# Altium schematic sheet Rotary-Encoder.SchDoc
size B; SheetNumber: 15; SheetTotal: 17
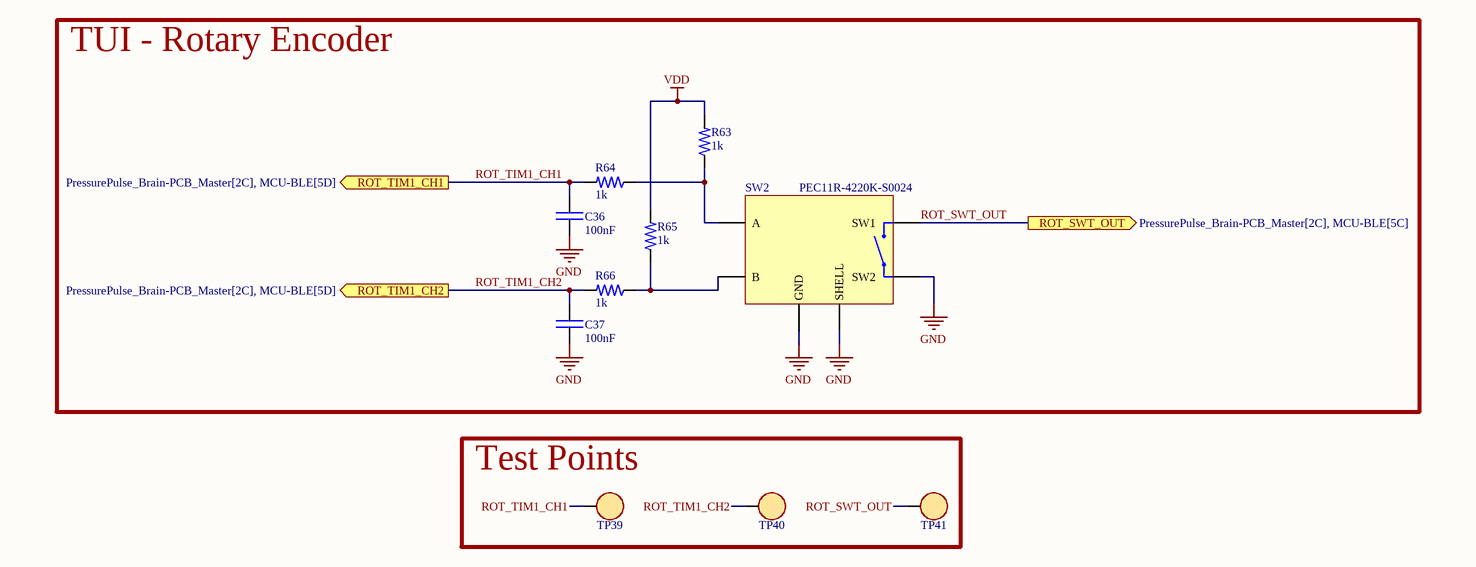
[diagram p0: Rotary-Encoder.SchDoc]

## Parts
C36  value 100nF  [0402C]  (hidden comment: CAP)
C37  value 100nF  [0402C]  (hidden comment: CAP)
R63  value 1k  [0402R]  (hidden comment: RES)
R64  value 1k  [0402R]  (hidden comment: RES)
R65  value 1k  [0402R]  (hidden comment: RES)
R66  value 1k  [0402R]  (hidden comment: RES)
SW2  PEC11R-4220K-S0024  [PEC11R-4220K-S0024]
TP39  RH-5019  [TP - RH-5019]  (value not drawn)
TP40  RH-5019  [TP - RH-5019]  (value not drawn)
TP41  RH-5019  [TP - RH-5019]  (value not drawn)

## Blocks framed on the sheet
TUI - Rotary Encoder: C36 C37 R63-R66 SW2
Test Points: TP39-TP41

## Ports
ROT_SWT_OUT (out, see PressurePulse_Brain-PCB_Master[2C], MCU-BLE[5C]), ROT_TIM1_CH1 (out, see PressurePulse_Brain-PCB_Master[2C], MCU-BLE[5D]), ROT_TIM1_CH2 (out, see PressurePulse_Brain-PCB_Master[2C], MCU-BLE[5D])

## Nets
GND: C36.1 C37.1 SW2.GND SW2.SHELL SW2.SW2
VDD: R63.2 R65.2
ROT_SWT_OUT: SW2.SW1 TP41.1 ; port ROT_SWT_OUT
ROT_TIM1_CH1: C36.2 R64.2 TP39.1 ; port ROT_TIM1_CH1
ROT_TIM1_CH2: C37.2 R66.2 TP40.1 ; port ROT_TIM1_CH2
NetR63_1: R63.1 R64.1 SW2.A
NetR65_1: R65.1 R66.1 SW2.B

## Library data of the parts
C36 C37 = CAP: Capacitor; MFR: *; MFR PN: *; JLCPCB PN: *; Footprint: *
R63-R66 = RES: Resistor; MFR PN: *; MFR: *; JLCPCB PN: *
SW2 = ROT ENCODER W SWITCH: Rotary Encoder Incremental 24 Quadrature, 2-Bit Vertical; MFR: Bourns Inc.; Value: DNS; MFR PN: PEC11R-4220K-S0024; JLCPCB PN: *
TP39-TP41 = TEST POINT: MFR: ronghe; MFR PN: RH-5019; Value: RH-5019; JLCPCB PN: C5199800